# EAGLE schematic SKEMATIK_BOARD 12V (06-07-2025) (EAGLE 9.7.0)
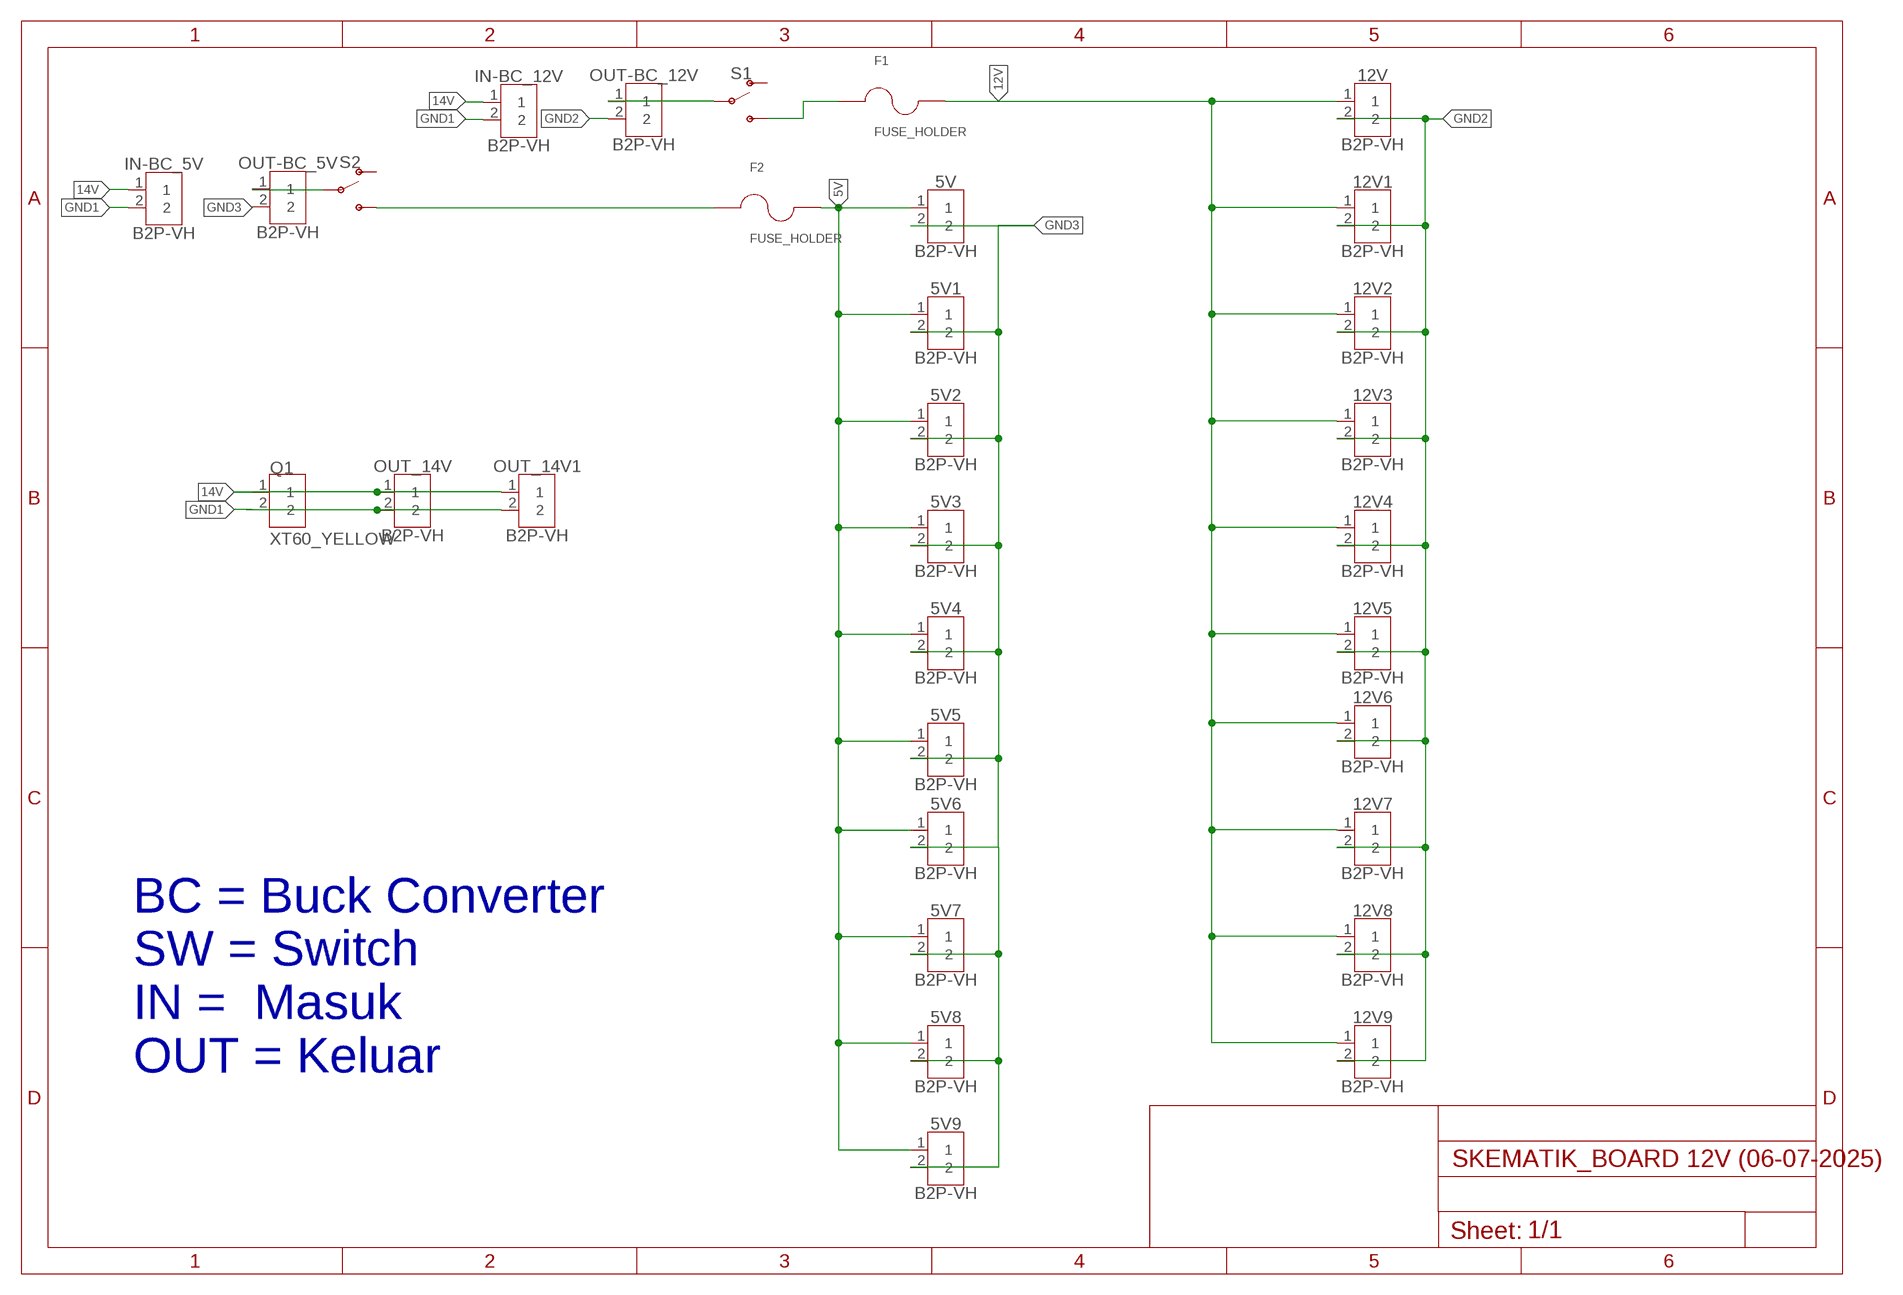
[diagram p0: schematic, sheet 1]

## Parts
5V  B2P-VH  [B2P-VH_396-2N]
5V1  B2P-VH  [B2P-VH_396-2N]
5V2  B2P-VH  [B2P-VH_396-2N]
5V3  B2P-VH  [B2P-VH_396-2N]
5V4  B2P-VH  [B2P-VH_396-2N]
5V5  B2P-VH  [B2P-VH_396-2N]
5V6  B2P-VH  [B2P-VH_396-2N]
5V7  B2P-VH  [B2P-VH_396-2N]
5V8  B2P-VH  [B2P-VH_396-2N]
5V9  B2P-VH  [B2P-VH_396-2N]
12V  B2P-VH  [B2P-VH_396-2N]
12V1  B2P-VH  [B2P-VH_396-2N]
12V2  B2P-VH  [B2P-VH_396-2N]
12V3  B2P-VH  [B2P-VH_396-2N]
12V4  B2P-VH  [B2P-VH_396-2N]
12V5  B2P-VH  [B2P-VH_396-2N]
12V6  B2P-VH  [B2P-VH_396-2N]
12V7  B2P-VH  [B2P-VH_396-2N]
12V8  B2P-VH  [B2P-VH_396-2N]
12V9  B2P-VH  [B2P-VH_396-2N]
F1  FUSE_HOLDER  [FUSE_4628]
F2  FUSE_HOLDER  [FUSE_4628]
IN-BC_5V  B2P-VH  [B2P-VH_396-2N]
IN-BC_12V  B2P-VH  [B2P-VH_396-2N]
OUT-BC_5V  B2P-VH  [B2P-VH_396-2N]
OUT-BC_12V  B2P-VH  [B2P-VH_396-2N]
OUT_14V  B2P-VH  [B2P-VH_396-2N]
OUT_14V1  B2P-VH  [B2P-VH_396-2N]
Q1  XT60_YELLOW  [AMASS_XT60PB-M]
S1  SWITCH-SPDT-PTH-11.6X4.0MM  [SWITCH_SPDT_PTH_11.6X4.0MM]
S2  SWITCH-SPDT-PTH-11.6X4.0MM  [SWITCH_SPDT_PTH_11.6X4.0MM]

## Nets
5V: 5V1.1 5V2.1 5V3.1 5V4.1 5V5.1 5V6.1 5V7.1 5V8.1 5V9.1 5V.1 F2.2
12V: 12V1.1 12V2.1 12V3.1 12V4.1 12V5.1 12V6.1 12V7.1 12V8.1 12V9.1 12V.1 F1.2
14V: IN-BC_5V.1 IN-BC_12V.1 OUT_14V1.1 OUT_14V.1 Q1.1
GND1: IN-BC_5V.2 IN-BC_12V.2 OUT_14V1.2 OUT_14V.2 Q1.2
GND2: 12V1.2 12V2.2 12V3.2 12V4.2 12V5.2 12V6.2 12V7.2 12V8.2 12V9.2 12V.2 OUT-BC_12V.2
GND3: 5V1.2 5V2.2 5V3.2 5V4.2 5V5.2 5V6.2 5V7.2 5V8.2 5V9.2 5V.2 OUT-BC_5V.2
N$1: OUT-BC_12V.1 S1.2(P)
N$3: OUT-BC_5V.1 S2.2(P)
N$4: F2.1 S2.3(S)
N$5: F1.1 S1.3(S)
Unconnected: S1.1(O) S2.1(O)

## Notes on the sheet
- BC = Buck Converter
  SW = Switch
  IN =  Masuk
  OUT = Keluar

## Library data of the parts
5V 5V1-5V9 12V 12V1-12V9 IN-BC_5V IN-BC_12V OUT-BC_5V OUT-BC_12V OUT_14V OUT_14V1 = Connector:B2P-VH: VH Connector Top Entry - 2POS-3.96MM Details see: Datasheet <http://www.jst-mfg.com/product/pdf/eng/eVH.pdf>; CATEGORY: Header; DATASHEET: https://www.jst-mfg.com/product/pdf/eng/eVH.pdf; DESCRIPTION: Connector Header Through Hole 3 position 0.156" (3.96mm); MANUFACTURER: JST Sales America Inc.; MPN: B2P-VH; OPERATING_TEMPERATURE: -25°C ~ 85°C; PACKAGE_SIZE: NA; PACKAGE_TYPE: THT; PART_STATUS: ACTIVE; PITCH: 0.156" (3.96mm); ROHS: COMPLIANT; SERIES: VH; SUBCATEGORY: Rectangular Connectors; TYPE: Header-Male Pin-Board to Cable/Wire-Through Hole
F1 F2 = 4628:FUSE_HOLDER: Check availability <https://pricing.snapeda.com/parts/4628/Keystone/view-part?ref=eda>; AVAILABILITY: In Stock; CHECK_PRICES: https://www.snapeda.com/parts/4628/Keystone/view-part/?ref=eda; DESCRIPTION: Fuse Holder 5 A 250V 1 Circuit Cartridge Through Hole; MF: Keystone; MP: 4628; PACKAGE: None; PRICE: None; SNAPEDA_LINK: https://www.snapeda.com/parts/4628/Keystone/view-part/?ref=snap
Q1 = XT60_YELLOW:XT60_YELLOW: Check availability <https://pricing.snapeda.com/parts/XT60%20YELLOW/Pololu/view-part?ref=eda>; AVAILABILITY: Not in stock; CHECK_PRICES: https://www.snapeda.com/parts/XT60%20YELLOW/Pololu/view-part/?ref=eda; DESCRIPTION: Power connector; 65A; PIN: 2; Colour: yellow; MF: Pololu; MP: XT60 YELLOW; PACKAGE: None; PRICE: None; SNAPEDA_LINK: https://www.snapeda.com/parts/XT60%20YELLOW/Pololu/view-part/?ref=snap
S1 S2 = SparkFun-Switches:SWITCH-SPDT: Single Pole, Double Throw (SPDT) Switch Single-pole, double-throw (SPDT) switch. Variant Overview SMD-AYZ0202 Surface Mount DPDT Switch <https://www.sparkfun.com/products/597> (COM-00597) Used on e.g. LilyPad Arduino USB - ATmega32U4 Board <https://www.sparkfun.com/products/12049> PTH-11.6X4.0MM SPDT Mini Power Switch <https://www.sparkfun.com/products/102> (COM-00102) Used on e.g. SparkFun Simon Says - Through-Hole Soldering Kit <https://www.sparkfun.com/products/10547> (KIT-10547) PTH-11.6X4.0MM-KIT KIT version of SPDT Mini Power Switch - Simplifies soldering by removing tStop of switch pins - only one side can be soldered. PTH-11.6X4.0MM-LOCK LOCK version of SPDT Mini Power Switch - Offset pins hold switch in place for easier soldering. SMD-RIGHT-ANGLE Surface Mount Right Angle Switch <https://www.sparkfun.com/products/10860> (COM-10860) Used on e.g. SparkFun ESP8266 Thing <https://www.sparkfun.com/products/13231>; PROD_ID: SWCH-08261; SF_SKU: COM-00102